# Altium schematic sheet DAC_channel.SchDoc: DAC
size 420 x 297 mm; Author: G.K.; CompanyName: WUT; DrawnBy: G.K.; Organization: CERN; Address1: Warsaw Univeristy of Technology; Address2: Nowowiejska 15/19; Revision: -; SheetNumber: -; SheetTotal: -; EDA_Number: ARTIQ; Projet: ADC/DAC MEZZANINE; ModifiedBy: -; CreateDate: XX/XX/XXXX; CheckedDate: -; Title2: Output channel; DivGrp: ISE; Designer: G.K.; ModifiedDate: -; ProjectName: ADC/DAC MEZZANINE
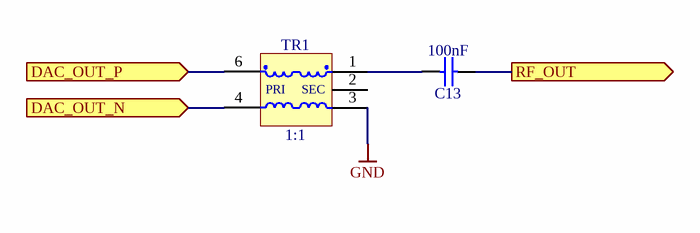
[diagram p0: DAC_channel.SchDoc]

## Parts
C13  100nF  [CAPC1608X87N]
TR1  1:1  [XFMR_MINI-CIRCUITS_AT224]

## Ports
DAC_OUT_N (in), DAC_OUT_P (in), RF_OUT (out)

## Nets
GND: TR1.3(S)
DAC_OUT_N: TR1.4(P) ; port DAC_OUT_N
DAC_OUT_P: TR1.6(PDOT) ; port DAC_OUT_P
RF_OUT: C13.1 ; port RF_OUT
NetC13_2: C13.2 TR1.1(SDOT)

Not connected (* = marked no-connect by the designer): TR1 2(NC)

## Notes on the sheet
- Project/Equipment
- Designer
- Drawn by
- Check.by
- File
- Last Mod.
- Print Date
- Sheet
- Size
- A3
- of
- Rev
- (in symbol XFMR_MINI-CIRCUITS_TC1-1-13M+) PRI; SEC

## Library data of the parts
C13 = CC0603_100NF_50V_10%_X7R: Non-polarised capacitor; Part Description: SMD Multilayer Chip Ceramic Capacitor; Manufacturer: GENERIC; Manufacturer1 Part Number: 223858615649; Voltage: 50V; TC: X7R; Tolerance: ±10%; Part Number: CC0603_100NF_50V_10%_X7R; Component Kind: Standard; Component Type: Standard; Pin Count: 2; Value: 100nF; Status: Preferred; Manufacturer Part Number: CC0603_100NF_50V_10%_X7R; Case: 0603; Mounted: Yes; Socket: No; SMD: Yes; Sense: No; Manufacturer1 Example: PHYCOMP; Manufacturer1 ComponentHeight: 0.87mm; HelpURL: \\cern.ch\dfs\Applications\Altium\Datasheets\CC0603_X7R_PHYCOMP.pdf; Author: CERN DEM JLC; CreateDate: 03.12.2007; LatestRevisionDate: 03.12.2007
TR1 = XFMR_MINI-CIRCUITS_TC1-1-13M+: 50 Ohms 4.5 To 3000MHz RF Transformers; Part Number: XFMR_MINI-CIRCUITS_TC1-1-13M+; Component Kind: Standard; Component Type: Standard; Pin Count: 5; Value: 1:1; Status: None; Part Description: 50 Ohms 4.5 To 3000MHz RF Transformer; Manufacturer: MINI-CIRCUITS; Manufacturer Part Number: TC1-1-13M+; Mounted: Yes; Socket: No; Sense: No; SMD: Yes; ComponentHeight: 3.81mm; HelpURL: \\cern.ch\dfs\Applications\Altium\Datasheets\XFMR_MINI-CIRCUITS_TC1-1-13M+.pdf; Author: CERN DEM JLC; CreateDate: 30.11.2011; LatestRevisionDate: 30.11.2011